# EAGLE design INPUT 1 (EAGLE 9.6.2)
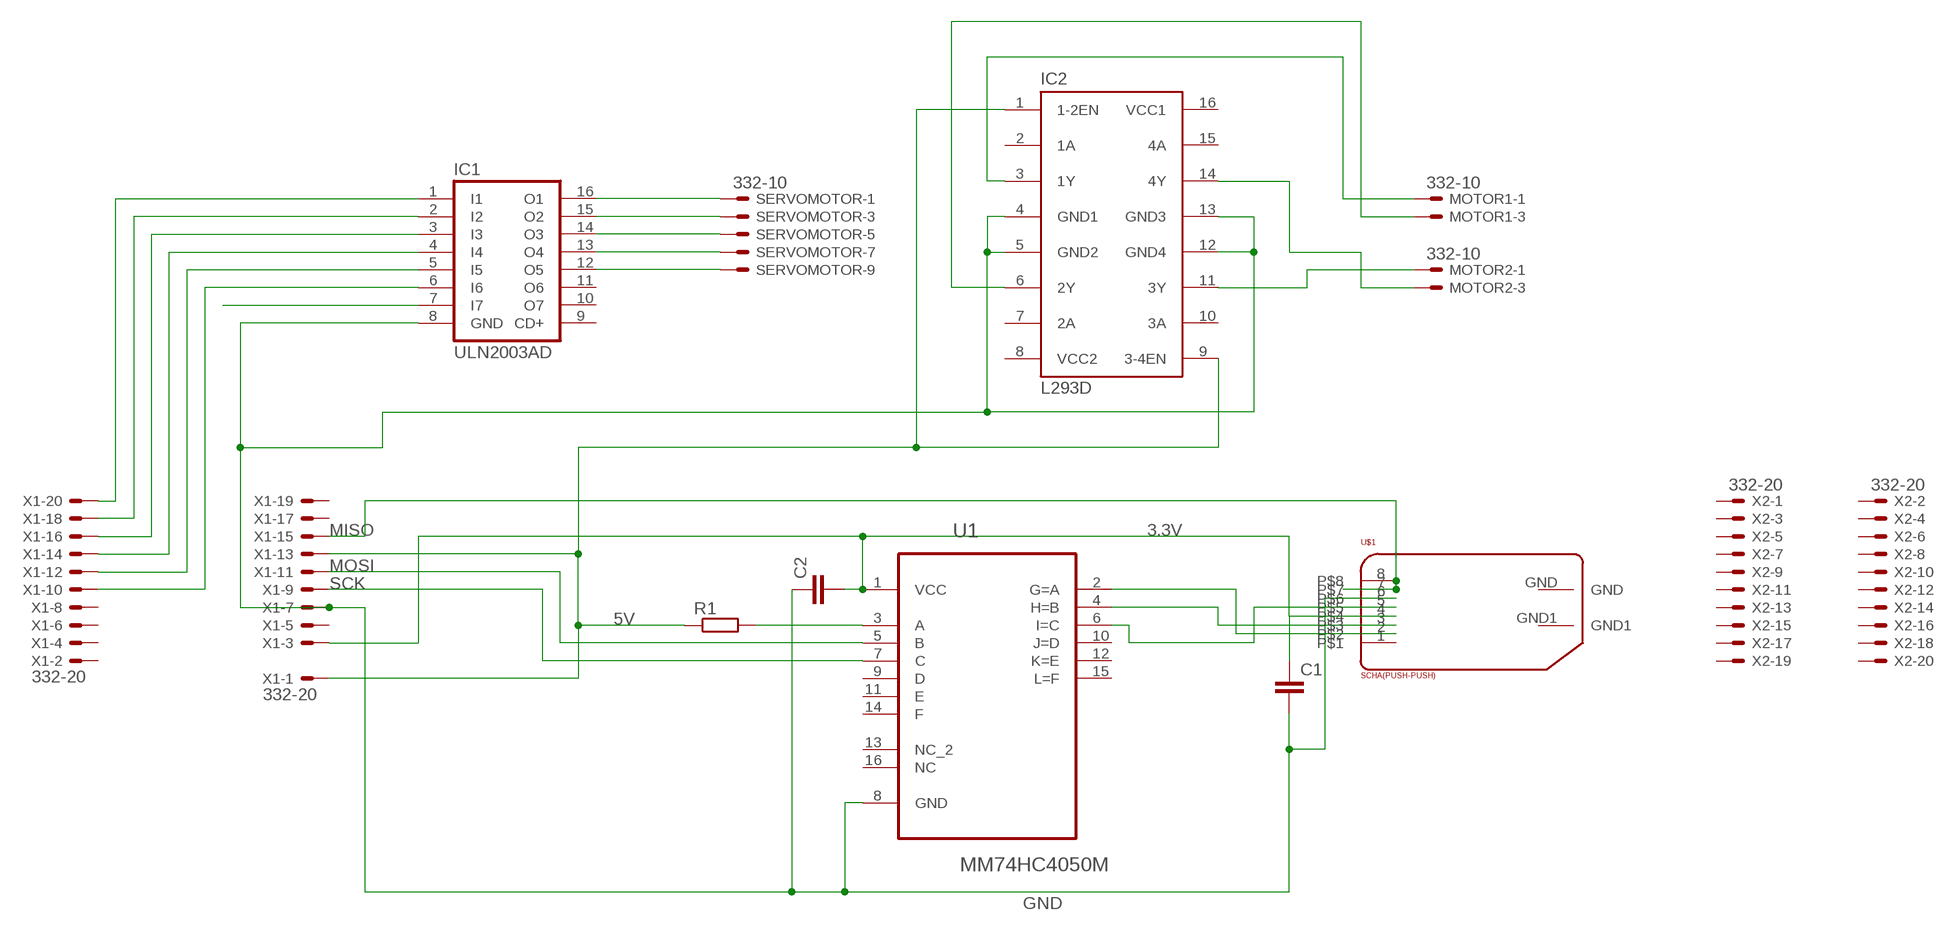
[diagram p0: schematic, sheet 1]

## Parts
C1  C-EUC0603  [C0603]
C2  C-EUC0603  [C0603]
IC1  ULN2003AD  [SO16]
IC2  L293D  [DIL16]
MOTOR1  332-10  [332-10]
MOTOR2  332-10  [332-10]
R1  R-EU_R0603  [R0603]
SERVOMOTOR  332-10  [332-10]
U1  MM74HC4050M  [SOIC127P600X175-16N]
U$1  SCHA(PUSH-PUSH)  [SCHA(PUCH-PUCH_TYPE)]
X1  332-20  [332-20]
X2  332-20  [332-20]

## Nets
3.3V: C1.1 C2.2 U1.1(VCC) U$1.4 X1.3
5V: IC2.1(1-2EN) IC2.9(3-4EN) R1.1 X1.1 X1.13
GND: C1.2 C2.1 IC1.8(GND) IC2.4(GND1) IC2.5(GND2) IC2.12(GND4) IC2.13(GND3) U1.8(GND) U$1.6 X1.7
MISO: U$1.7 U$1.8 X1.15
MOSI: U1.5(B) X1.11
N$1: U1.2(G=A) U$1.2
N$2: U1.4(H=B) U$1.3
N$3: R1.2 U1.3(A)
N$4: IC1.1(I1) X1.20
N$5: U1.6(I=C) U$1.5
N$6: IC1.2(I2) X1.18
N$7: IC1.3(I3) X1.16
N$8: IC1.4(I4) X1.14
N$9: IC1.5(I5) X1.12
N$10: IC1.6(I6) X1.10
N$11: IC1.7(I7)
N$12: IC1.16(O1) SERVOMOTOR.1
N$13: IC1.15(O2) SERVOMOTOR.3
N$14: IC1.14(O3) SERVOMOTOR.5
N$15: IC1.13(O4) SERVOMOTOR.7
N$16: IC1.12(O5) SERVOMOTOR.9
N$17: IC2.3(1Y) MOTOR1.1
N$18: IC2.6(2Y) MOTOR1.3
N$19: IC2.11(3Y) MOTOR2.1
N$20: IC2.14(4Y) MOTOR2.3
SCK: U1.7(C) X1.9
Unconnected: IC1.9(CD+) IC1.10(O7) IC1.11(O6) IC2.2(1A) IC2.7(2A) IC2.10(3A) IC2.15(4A) MOTOR1.2 MOTOR1.4 MOTOR1.5 MOTOR1.6 MOTOR1.7 MOTOR1.8 MOTOR1.9 MOTOR1.10 MOTOR2.2 MOTOR2.4 MOTOR2.5 MOTOR2.6 MOTOR2.7 MOTOR2.8 MOTOR2.9 MOTOR2.10 SERVOMOTOR.2 SERVOMOTOR.4 SERVOMOTOR.6 SERVOMOTOR.8 SERVOMOTOR.10 U1.9(D) U1.10(J=D) U1.11(E) U1.12(K=E) U1.13(NC_2) U1.14(F) U1.15(L=F) U1.16(NC) U$1.1 U$1.GND U$1.GND1 X1.2 X1.4 X1.5 X1.6 X1.8 X1.17 X1.19 X2.1 X2.2 X2.3 X2.4 X2.5 X2.6 X2.7 X2.8 X2.9 X2.10 X2.11 X2.12 X2.13 X2.14 X2.15 X2.16 X2.17 X2.18 X2.19 X2.20

## Power pins joined to a net without a drawn wire
VCC1: IC2.16(VCC1)
VCC2: IC2.8(VCC2)

## Library data of the parts
C1 C2 = rcl:C-EU: CAPACITOR, European symbol; SPICEPREFIX: C
IC1 = uln-udn:ULN2003A: DRIVER ARRAY
IC2 = st-microelectronics:L293D: PUSH-PULL 4 CHANNEL DRIVER; MPN: L293D; OC_FARNELL: 9589619; OC_NEWARK: 56P8249
MOTOR1 MOTOR2 SERVOMOTOR = con-garry:332-10: 10 Pin - 2mm Dual Row Source: www.mpe-connector.de / garry_shortform_2012.pdf
R1 = rcl:R-EU_: RESISTOR, European symbol; SPICEPREFIX: R
U1 = MM74HC4050M:MM74HC4050M: Hex Inverting Logic Level Down Converter Check prices <https://pricing.snapeda.com/search/part/MM74HC4050M/?ref=eda>; AVAILABILITY: Warning; DESCRIPTION: Buffer, Non-Inverting 6 Element 1 Bit per Element Push-Pull Output 16-TSSOP; MF: ON Semiconductor; MP: MM74HC4050M; PACKAGE: SOIC-16 Fairchild Semiconductor; PRICE: None; PURCHASE-URL: https://pricing.snapeda.com/search/part/MM74HC4050M/?ref=eda
U$1 = custom1:SCHA(PUSH-PUSH)
X1 X2 = con-garry:332-20: 20 Pin - 2mm Dual Row Source: www.mpe-connector.de / garry_shortform_2012.pdf

## Board
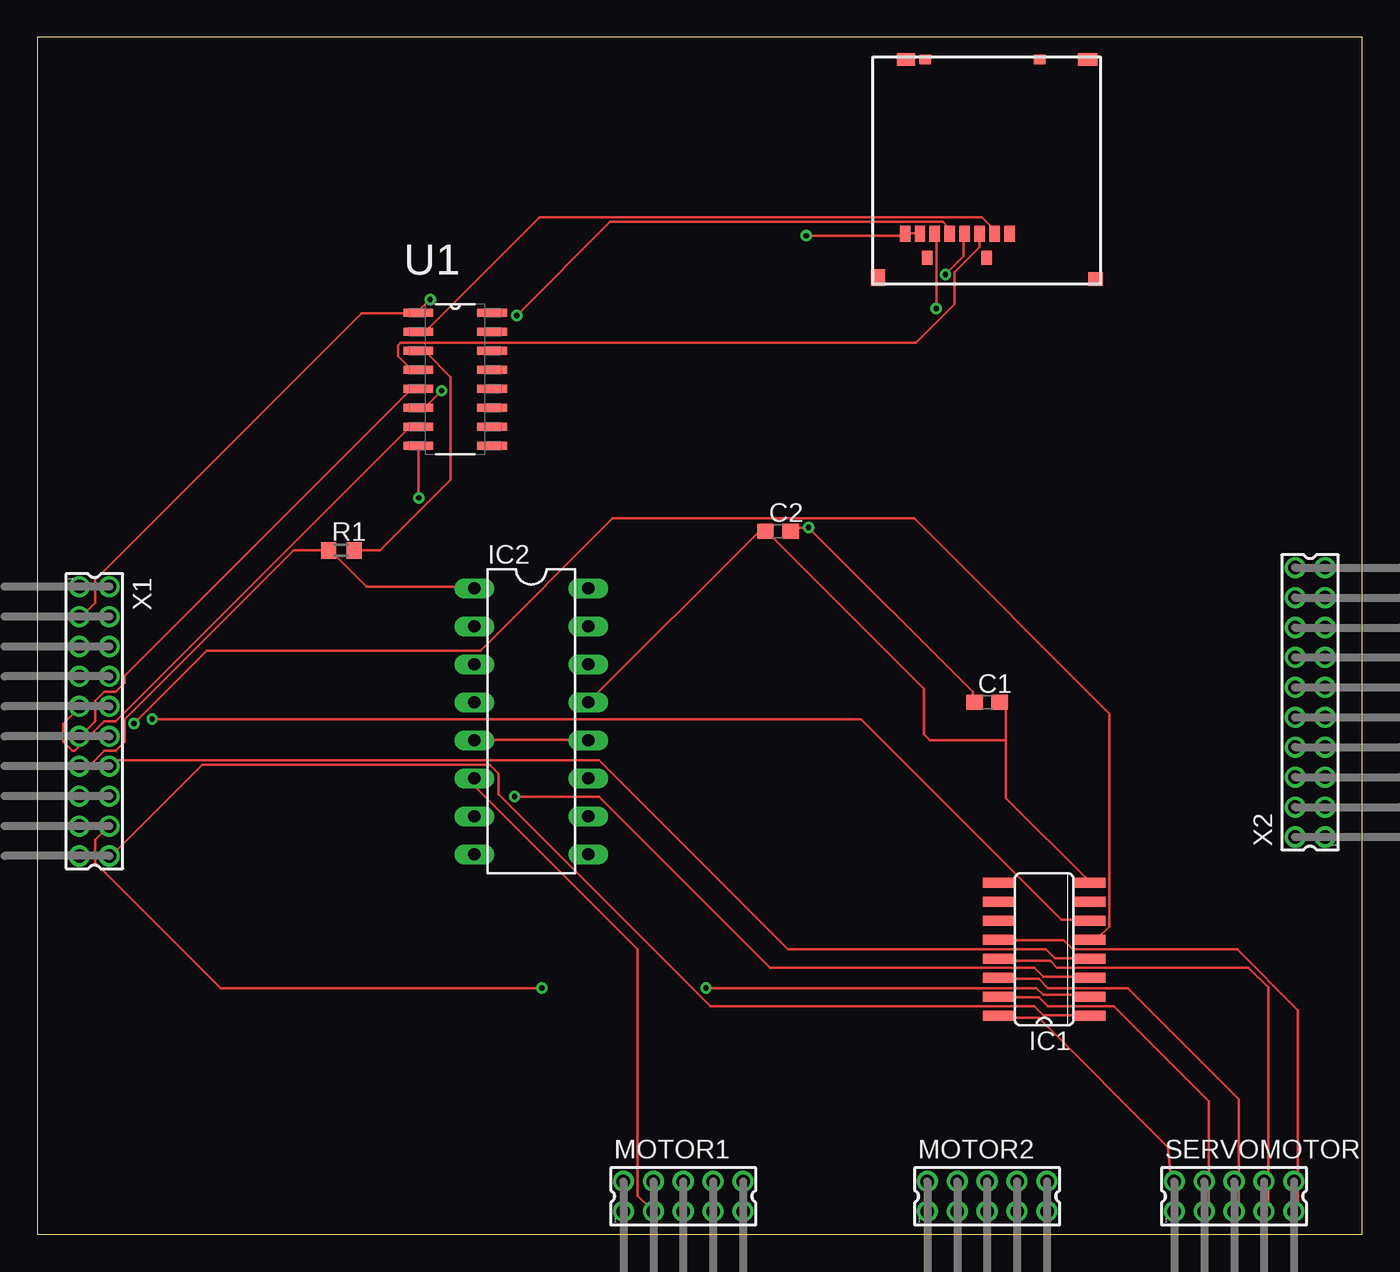
[diagram p1: board, top side]
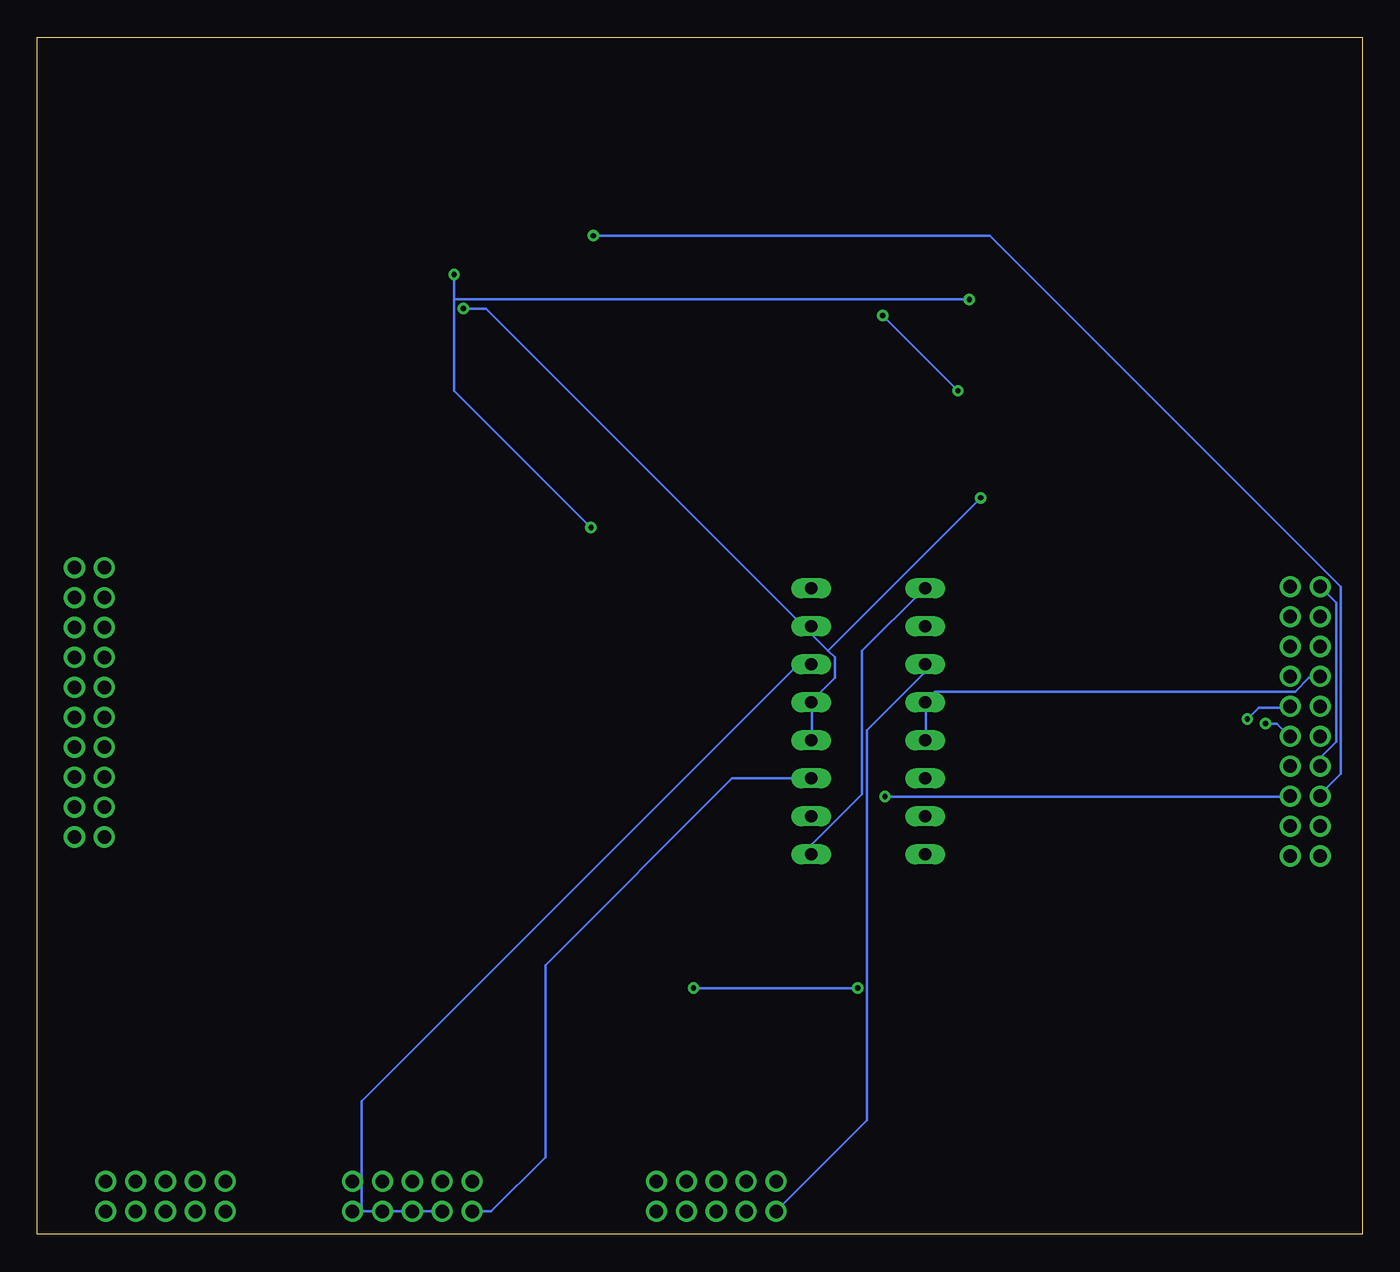
[diagram p2: board, bottom side, seen from below]

Size 88.57 x 80 mm. Coordinates in mm from the lower left corner, seen from the top.
Outline: 0,0 88.57,0 88.57,80 0,80 0,0
Copper layers (1*16): Top 0.035mm / dielectric 1.5mm / Bottom 0.035mm
Design rules "default": minimum track width 6mil, minimum drill 0.35mm, track to track 6mil, track to pad 6mil, pad to pad 6mil, via to via 6mil, smd to smd 6mil, copper to edge 40mil, drill to drill 6mil, minimum pad ring 10mil, minimum via ring 8mil, stop-mask expansion 4mil, vias tented up to drill 0mil, thermal gap 10mil

### Footprints (pad centres in the part's own frame; a part is rotated, then mirrored left to right if it is on the bottom)
C0603 = smd 1.1 x 1: 1 -0.85,0; 2 0.85,0
SO16 = smd 0.66 x 2.032: 1 -4.445,-3.073; 2 -3.175,-3.073; 3 -1.905,-3.073; 4 -0.635,-3.073; 5 0.635,-3.073; 6 1.905,-3.073; 7 3.175,-3.073; 8 4.445,-3.073; 9 4.445,3.073; 10 3.175,3.073; 11 1.905,3.073; 12 0.635,3.073; 13 -0.635,3.073; 14 -1.905,3.073; 15 -3.175,3.073; 16 -4.445,3.073
DIL16 = drill 0.813 long: 1 -8.89,-3.81; 2 -6.35,-3.81; 3 -3.81,-3.81; 4 -1.27,-3.81; 5 1.27,-3.81; 6 3.81,-3.81; 7 6.35,-3.81; 8 8.89,-3.81; 9 8.89,3.81; 10 6.35,3.81; 11 3.81,3.81; 12 1.27,3.81; 13 -1.27,3.81; 14 -3.81,3.81; 15 -6.35,3.81; 16 -8.89,3.81
332-10 = drill 0.9 pad 1.27: 1 -4,-1; 2 -4,1; 3 -2,-1; 4 -2,1; 5 0,-1; 6 0,1; 7 2,-1; 8 2,1; 9 4,-1; 10 4,1
R0603 = smd 1 x 1.1: 1 -0.85,0; 2 0.85,0
SOIC127P600X175-16N = smd 1.981 x 0.559: 1 -2.464,4.445; 2 -2.464,3.175; 3 -2.464,1.905; 4 -2.464,0.635; 5 -2.464,-0.635; 6 -2.464,-1.905; 7 -2.464,-3.175; 8 -2.464,-4.445; 9 2.464,-4.445; 10 2.464,-3.175; 11 2.464,-1.905; 12 2.464,-0.635; 13 2.464,0.635; 14 2.464,1.905; 15 2.464,3.175; 16 2.464,4.445
SCHA(PUCH-PUCH_TYPE) = smd 0.7 x 1.05: 1 9.125,3.375; 2 8.125,3.375; 3 7.125,3.375; 4 6.125,3.375; 5 5.125,3.375; 6 4.125,3.375; 7 3.125,3.375; 8 2.125,3.375 | smd 0.7 x 0.95: GND 3.625,1.775; GND1 7.6,1.775 | smd 0.95 x 0.9: P$2 14.875,0.35 | smd 0.95 x 1.1: P$3 0.325,0.45 | smd 1.2 x 0.85: P$4 2.175,15.025 | smd 0.75 x 0.65: P$5 3.475,15.025; P$7 11.125,15.025 | smd 1.3 x 0.85: P$6 14.325,15.025
332-20 = drill 0.9 pad 1.27: 1 -9,-1; 2 -9,1; 3 -7,-1; 4 -7,1; 5 -5,-1; 6 -5,1; 7 -3,-1; 8 -3,1; 9 -1,-1; 10 -1,1; 11 1,-1; 12 1,1; 13 3,-1; 14 3,1; 15 5,-1; 16 5,1; 17 7,-1; 18 7,1; 19 9,-1; 20 9,1

### Placement (x,y rotation side)
C1  63.5,35.56 0 top
C2  49.53,46.99 0 top
IC1  67.31,19.05 90 top
IC2  33.02,34.29 270 top
MOTOR1  43.18,2.54 0 top
MOTOR2  63.5,2.54 0 top
R1  20.32,45.72 0 top
SERVOMOTOR  80.01,2.54 0 top
U1  27.94,57.15 0 top
U$1  55.88,63.5 0 top
X1  3.81,34.29 270 top
X2  85.09,35.56 90 top

### Tracks (layer width: path | path; a pad name or v marks a point on that pad's centre or on a via)
3.3V  (via drill 0.35)
  Top 0.152: v60.71,64.16 61.93,65.38 61.93,66.75 U$1.4 | C2.2 50.49,47.09 50.65,47.24 v51.56,47.24 62.54,36.27 62.54,35.66 C1.1 | X1.3 2.95,41.3 3.86,42.22 3.86,43.74 21.69,61.57 25.35,61.57 U1.1 25.5,61.72 v26.26,62.48
  Bottom 0.152: 60.71,62.48 60.71,56.39 v51.56,47.24 | 60.71,62.48 v60.71,64.16 | v26.26,62.48 60.71,62.48
5V
  Top 0.152: IC2.1 29.16,43.28 22,43.28 19.56,45.72 R1.1 17.12,45.72 5.84,34.44 5.84,32.92 5.23,32.31 4.47,32.31 3.56,31.39 2.95,31.39 X1.13
  Bottom 0.152: X1.13 2.79,31.39 2.79,31.85 1.73,32.92 1.73,42.22 2.79,43.28 X1.1 | IC2.9 36.78,25.45 36.78,26.06 33.43,29.41 33.43,39.01 29.31,43.13 IC2.1
GND  (via drill 0.35)
  Top 0.152: C1.2 64.36,35.51 64.77,35.1 64.77,33.02 | IC1.8 70.31,23.62 64.77,29.16 64.77,33.02 | v60.1,61.87 60.1,66.75 U$1.6 | IC2.13 48.21,46.94 48.67,46.94 C2.1 48.82,46.94 59.28,36.47 59.28,33.43 59.69,33.02 64.77,33.02 | v25.5,49.23 25.5,52.58 U1.8 | IC2.5 29.31,33.07 36.78,33.07 IC2.12
  Bottom 0.152: IC2.5 29.16,33.07 29.16,35.51 IC2.4 29.16,35.66 28.55,36.27 4.47,36.27 3.56,37.19 2.95,37.19 X1.7 | v60.1,61.87 58.57,61.87 35.71,39.01 | 35.71,39.01 35.25,38.56 35.25,37.19 36.78,35.66 IC2.13 36.78,35.51 36.78,33.07 IC2.12 | 35.71,39.01 v25.5,49.23
MISO  (via drill 0.35)
  Top 0.152: U$1.7 58.88,66.9 58.12,66.9 U$1.8 57.96,66.75 v51.41,66.75
  Bottom 0.152: v51.41,66.75 24.89,66.75 1.42,43.28 1.42,30.79 2.79,29.41 X1.15
MOSI
  Top 0.152: U1.5 25.35,56.39 24.89,56.39 5.84,37.34 5.84,36.88 5.23,36.27 4.47,36.27 3.86,35.66 3.86,34.29 2.95,33.38 X1.11
N$1
  Top 0.152: U$1.2 63.91,66.9 63.91,67.21 63.14,67.97 33.58,67.97 25.96,60.35 25.5,60.35 U1.2
N$2
  Top 0.152: U$1.3 62.99,66.75 62.99,65.99 61.32,64.31 61.32,62.18 58.73,59.59 24.28,59.59 24.13,59.44 24.13,58.67 24.89,57.91 25.35,57.91 U1.4
N$3
  Top 0.152: R1.2 22.91,45.72 27.63,50.44 27.63,57.3 25.96,58.98 25.5,58.98 U1.3
N$4
  Top 0.152: IC1.1 70.31,14.63 67.26,14.63 66.65,15.24 45.01,15.24 30.84,29.41 30.84,30.79 30.23,31.39 11.02,31.39 4.93,25.3 X1.20
N$5  (via drill 0.35)
  Top 0.152: v32.05,61.42 38.3,67.67 60.55,67.67 60.86,67.36 60.86,66.9 U$1.5 | v27.03,56.39 25.96,55.32 25.5,55.32 U1.6
  Bottom 0.152: v27.03,56.39 v32.05,61.42
N$6  (via drill 0.35)
  Top 0.152: v44.7,16.46 66.8,16.46 67.26,16 70.31,16 IC1.2 | v33.73,16.46 12.24,16.46 3.86,24.84 3.86,26.36 4.78,27.28 X1.18
  Bottom 0.152: v33.73,16.46 v44.7,16.46
N$7  (via drill 0.35)
  Top 0.152: v31.9,29.26 37.54,29.26 48.97,17.83 66.65,17.83 67.26,17.22 70.31,17.22 IC1.3
  Bottom 0.152: v31.9,29.26 4.93,29.26 X1.16
N$8
  Top 0.152: IC1.4 70.31,18.44 68.02,18.44 67.41,19.05 50.19,19.05 37.54,31.7 5.23,31.7 4.93,31.39 X1.14
N$9  (via drill 0.35)
  Top 0.152: v6.45,34.14 11.33,39.01 29.62,39.01 38.46,47.85 58.62,47.85 71.68,34.8 71.68,20.57 70.92,19.81 70.46,19.81 IC1.5
  Bottom 0.152: v6.45,34.14 5.69,34.14 4.93,33.38 X1.12
N$10  (via drill 0.35)
  Top 0.152: v7.67,34.44 55.07,34.44 68.48,21.03 70.31,21.03 IC1.6
  Bottom 0.152: v7.67,34.44 6.91,35.2 4.93,35.2 X1.10
N$12
  Top 0.152: IC1.16 64.36,14.48 66.95,14.48 75.59,5.84 SERVOMOTOR.1
N$13
  Top 0.152: IC1.15 64.36,15.85 66.95,15.85 67.56,15.24 71.98,15.24 78.33,8.89 78.33,1.54 SERVOMOTOR.3
N$14
  Top 0.152: IC1.14 64.36,17.07 66.95,17.07 67.56,16.46 72.9,16.46 80.32,9.04 80.32,1.54 SERVOMOTOR.5
N$15
  Top 0.152: IC1.13 64.36,18.29 67.72,18.29 68.17,17.83 80.98,17.83 82.3,16.51 82.3,1.54 SERVOMOTOR.7
N$16
  Top 0.152: IC1.12 64.36,19.66 68.63,19.66 69.24,19.05 80.21,19.05 84.28,14.99 84.28,1.54 SERVOMOTOR.9
N$17
  Bottom 0.152: IC2.3 29.31,38.1 29.31,37.49 33.12,33.68 33.12,7.62 39.06,1.68 MOTOR1.1
N$18
  Top 0.152: IC2.6 29.31,30.48 29.31,29.87 40.13,19.05 40.13,2.59 41.05,1.68 MOTOR1.3
N$19
  Bottom 0.152: IC2.11 42.11,30.48 54.61,17.98 54.61,5.16 58.23,1.54 MOTOR2.1
N$20
  Bottom 0.152: IC2.14 37.69,38.1 66.9,8.89 66.9,1.54 MOTOR2.3
SCK
  Top 0.152: U1.7 25.35,53.95 24.89,53.95 5.23,34.29 4.47,34.29 2.49,32.31 2.34,32.31 1.73,32.92 1.73,34.14 2.79,35.2 X1.9